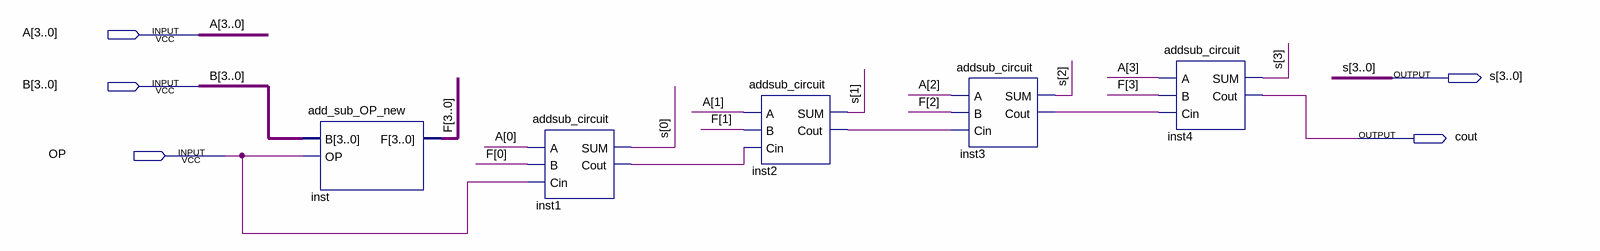
[diagram p0: schematic sheet]
// Quartus schematic add_sub_OP.bdf as structural Verilog: 5 symbols, 5 pins
module add_sub_OP (
  input  [3:0] A,
  input  [3:0] B,
  input  OP,
  output [3:0] s,
  output cout
);

  wire inst1_cout, inst2_cout, inst3_cout;
  wire [3:0] F;

  add_sub_OP_new inst (.B(B), .OP(OP), .F(F));
  addsub_circuit inst1 (.A(A[0]), .B(F[0]), .Cin(OP), .SUM(s[0]), .Cout(inst1_cout));
  addsub_circuit inst2 (.A(A[1]), .B(F[1]), .Cin(inst1_cout), .SUM(s[1]), .Cout(inst2_cout));
  addsub_circuit inst3 (.A(A[2]), .B(F[2]), .Cin(inst2_cout), .SUM(s[2]), .Cout(inst3_cout));
  addsub_circuit inst4 (.A(A[3]), .B(F[3]), .Cin(inst3_cout), .SUM(s[3]), .Cout(cout));
endmodule
